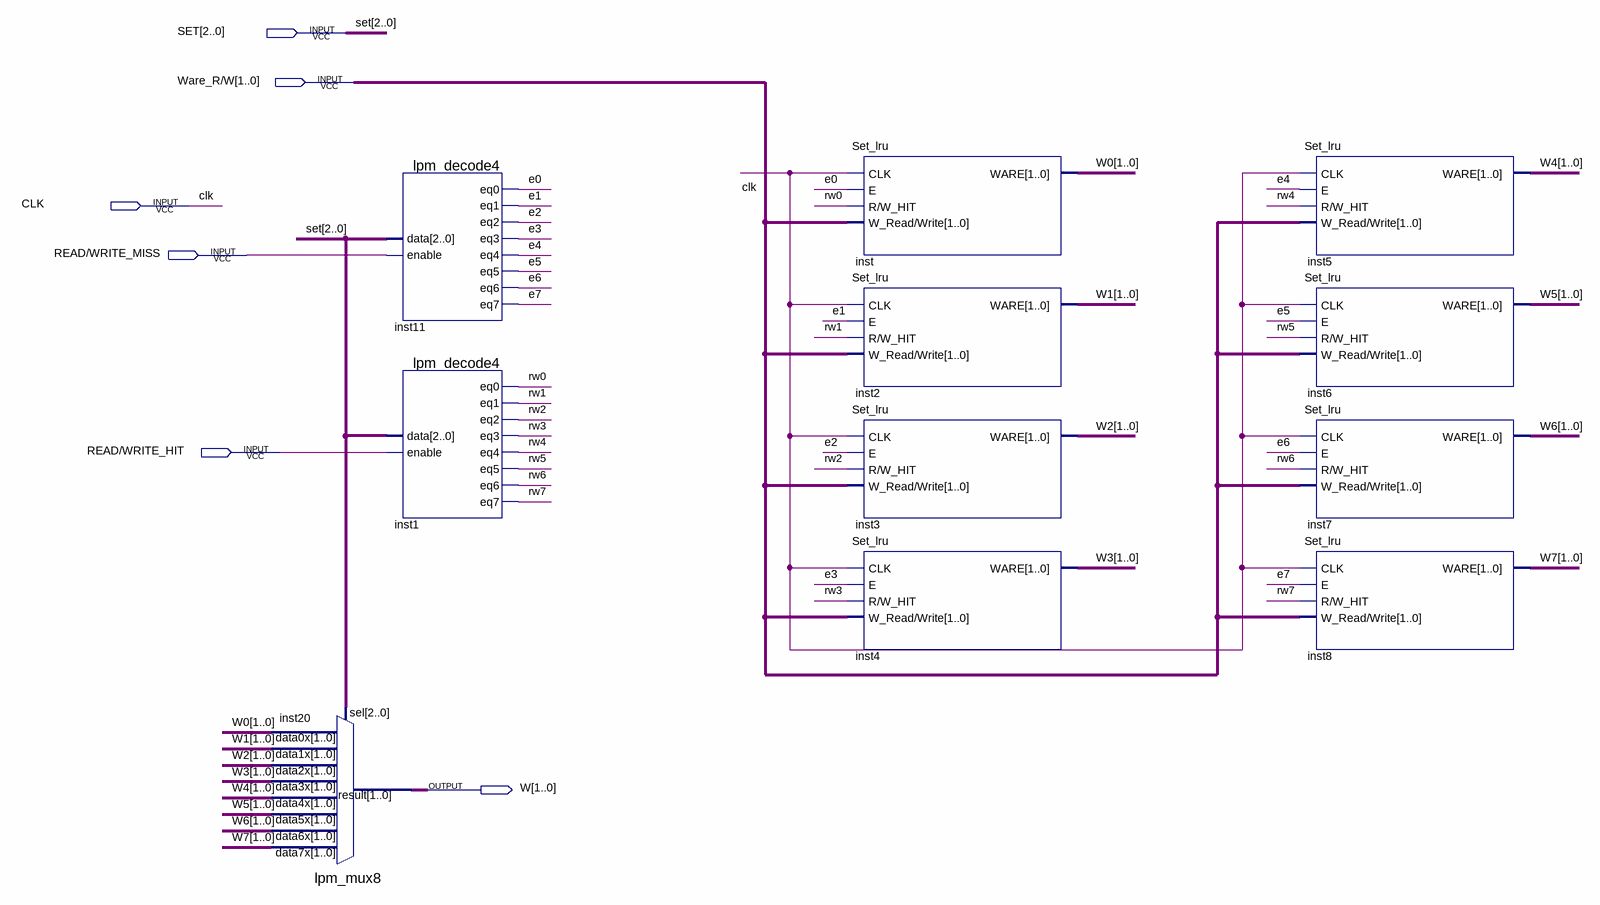
[diagram p0: schematic sheet]
// Quartus schematic LRU_CACHE.bdf as structural Verilog: 11 symbols, 6 pins
module LRU_CACHE (
  input  [2:0] SET,
  input  [1:0] \Ware_R/W ,
  input  CLK,
  input  \READ/WRITE_MISS ,
  input  \READ/WRITE_HIT ,
  output [1:0] W
);

  wire e0, e1, e2, e3, e4, e5, e6, e7, rw0, rw1, rw2, rw3, rw4, rw5, rw6, rw7;
  wire [1:0] W0, W1, W2, W3, W4, W5, W6, W7;

  lpm_mux8 inst20 (
    .data7x(W7), .data6x(W6), .data5x(W5), .data4x(W4), .data3x(W3), .data2x(W2), .data1x(W1), .data0x(W0),
    .sel(SET), .result(W));
  lpm_decode4 inst11 (
    .data(SET), .enable(\READ/WRITE_MISS ), .eq0(e0), .eq1(e1), .eq2(e2), .eq3(e3), .eq4(e4), .eq5(e5),
    .eq6(e6), .eq7(e7));
  lpm_decode4 inst1 (
    .data(SET), .enable(\READ/WRITE_HIT ), .eq0(rw0), .eq1(rw1), .eq2(rw2), .eq3(rw3), .eq4(rw4), .eq5(rw5),
    .eq6(rw6), .eq7(rw7));
  Set_lru inst (.CLK(CLK), .E(e0), .\R/W_HIT (rw0), .\W_Read/Write (\Ware_R/W ), .WARE(W0));
  Set_lru inst2 (.CLK(CLK), .E(e1), .\R/W_HIT (rw1), .\W_Read/Write (\Ware_R/W ), .WARE(W1));
  Set_lru inst3 (.CLK(CLK), .E(e2), .\R/W_HIT (rw2), .\W_Read/Write (\Ware_R/W ), .WARE(W2));
  Set_lru inst4 (.CLK(CLK), .E(e3), .\R/W_HIT (rw3), .\W_Read/Write (\Ware_R/W ), .WARE(W3));
  Set_lru inst5 (.CLK(CLK), .E(e4), .\R/W_HIT (rw4), .\W_Read/Write (\Ware_R/W ), .WARE(W4));
  Set_lru inst6 (.CLK(CLK), .E(e5), .\R/W_HIT (rw5), .\W_Read/Write (\Ware_R/W ), .WARE(W5));
  Set_lru inst7 (.CLK(CLK), .E(e6), .\R/W_HIT (rw6), .\W_Read/Write (\Ware_R/W ), .WARE(W6));
  Set_lru inst8 (.CLK(CLK), .E(e7), .\R/W_HIT (rw7), .\W_Read/Write (\Ware_R/W ), .WARE(W7));
endmodule
